# EAGLE design opt_isp6_prg_header (EAGLE 9.6.2)
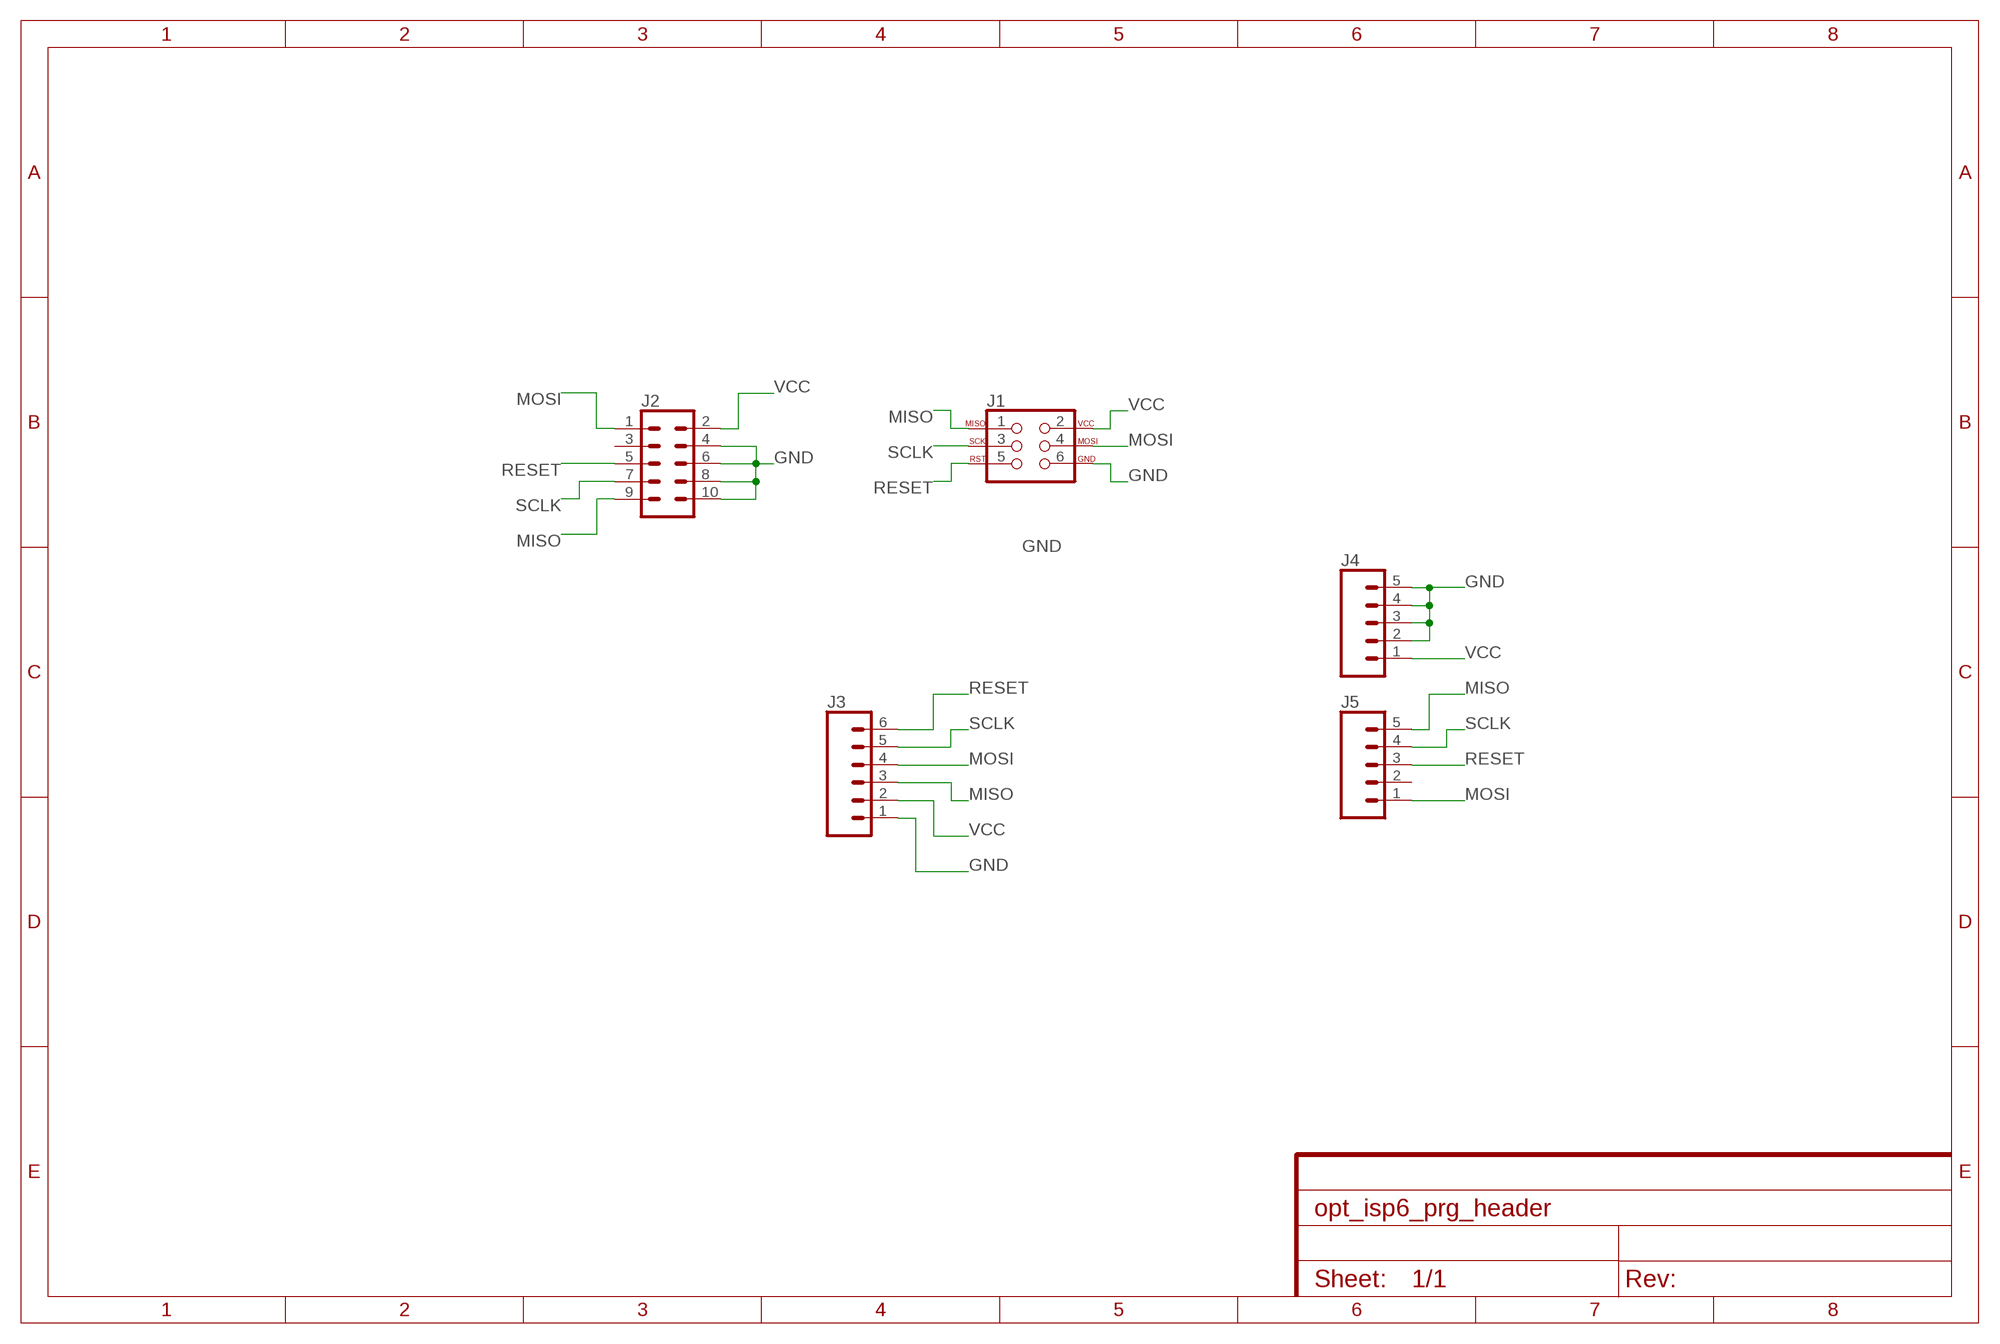
[diagram p0: schematic, sheet 1]

## Parts
J1  AVR_SPI_PROG_3X2NS  [2X3-NS]
J2  CONN_05X2SHD  [2X5-SHROUDED]
J3  CONN_06NO_SILK_NO_POP  [1X06_NO_SILK]
J4  CONN_05VERT_FEMALE_HEADER  [1X05_SMD_VERTICAL_COMBO]
J5  CONN_05VERT_FEMALE_HEADER  [1X05_SMD_VERTICAL_COMBO]

## Nets
GND: J1.6 J2.4 J2.6 J2.8 J2.10 J3.1 J4.2 J4.3 J4.4 J4.5
MISO: J1.1 J2.9 J3.3 J5.5
MOSI: J1.4 J2.1 J3.4 J5.1
RESET: J1.5 J2.5 J3.6 J5.3
SCLK: J1.3 J2.7 J3.5 J5.4
VCC: J1.2 J2.2 J3.2 J4.1
Unconnected: J2.3 J5.2

## Library data of the parts
J1 = SparkFun-Connectors:AVR_SPI_PROG_3X2: AVR ISP 6 Pin This is the reduced ISP connector for AVR programming. Common on Arduino. This footprint will take up less PCB space and can be used with a 10-pin to 6-pin adapter such as SKU: BOB-08508 **Special note about "TEST_POINT" package. The stop mask is on the top side, so if you want your programming test points to be on the bottom of your board, make sure to place this package on the bottom side of the board. This also ensure that the orientation to program from the bottom side will be correct. SparkFun Products: SparkFun ISP Pogo Adapter <https://www.sparkfun.com/products/11591> - NS Tiny AVR Programmer <https://www.sparkfun.com/products/11801> -PTH
J2 = SparkFun-Connectors:CONN_05X2: Multi connection point. Often used as Generic Header-pin footprint for 0.1 inch spaced/style header connections For AVR SPI programming port, see special device with nice symbol: "AVR_SPI_PROG_5x2.dev" You can populate with any combo of single row headers, but if you'd like an exact match, check these: 2x5 AVR ICSP Male Header <https://www.sparkfun.com/products/778> (PRT-00778) 2x5 Pin Shrouded Header <https://www.sparkfun.com/products/8506> (PRT-08506) On any of the 0.1 inch spaced packages, you can populate with these: Break Away Headers - Straight <https://www.sparkfun.com/products/116> (PRT-00116) Break Away Male Headers - Right Angle <https://www.sparkfun.com/products/553> (PRT-00553) Female Headers <https://www.sparkfun.com/products/115> (PRT-00115) Break Away Headers - Machine Pin <https://www.sparkfun.com/products/117> (PRT-00117) Break Away Female Headers - Swiss Machine Pin <https://www.sparkfun.com/products/743> (PRT-00743) Special note: the shrouded connector mates well with our 5x2 ribbon cables: 2x5 Pin IDC Ribbon Cable <https://www.sparkfun.com/products/8535> (PRT-08535); PROD_ID: CONN-08671; SF_ID: PRT-08506
J3 = SparkFun-Connectors:CONN_06: Multi connection point. Often used as Generic Header-pin footprint for 0.1 inch spaced/style header connections On any of the 0.1 inch spaced packages, you can populate with these: Break Away Headers - Straight <https://www.sparkfun.com/products/116> (PRT-00116) Break Away Male Headers - Right Angle <https://www.sparkfun.com/products/553> (PRT-00553) Female Headers <https://www.sparkfun.com/products/115> (PRT-00115) Break Away Headers - Machine Pin <https://www.sparkfun.com/products/117> (PRT-00117) Break Away Female Headers - Swiss Machine Pin <https://www.sparkfun.com/products/743> (PRT-00743) Arduino Stackable Header - 6 Pin <https://www.sparkfun.com/products/9280> (PRT-09280) For SCREWTERMINALS and SPRING TERMINALS visit here: Screw Terimnals on SparkFun.com <https://www.sparkfun.com/search/results?term=Screw+Terminals> (5mm/3.5mm/2.54mm spacing) This device is also useful as a general connection point to wire up your design to another part of your project. Our various solder wires solder well into these plated through hole pads. Hook-Up Wire - Assortment (Stranded, 22 AWG) <https://www.sparkfun.com/products/11375> (PRT-11375) Hook-Up Wire - Assortment (Solid Core, 22 AWG) <https://www.sparkfun.com/products/11367> (PRT-11367) View the entire wire category on our website here <https://www.sparkfun.com/categories/141>
J4 J5 = SparkFun-Connectors:CONN_05: Multi connection point. Often used as Generic Header-pin footprint for 0.1 inch spaced/style header connections On any of the 0.1 inch spaced packages, you can populate with these: Break Away Headers - Straight <https://www.sparkfun.com/products/116> (PRT-00116) Break Away Male Headers - Right Angle <https://www.sparkfun.com/products/553> (PRT-00553) Female Headers <https://www.sparkfun.com/products/115> (PRT-00115) Break Away Headers - Machine Pin <https://www.sparkfun.com/products/117> (PRT-00117) Break Away Female Headers - Swiss Machine Pin <https://www.sparkfun.com/products/743> (PRT-00743) For SCREWTERMINALS and SPRING TERMINALS visit here: Screw Terimnals on SparkFun.com <https://www.sparkfun.com/search/results?term=Screw+Terminals> (5mm/3.5mm/2.54mm spacing) This device is also useful as a general connection point to wire up your design to another part of your project. Our various solder wires solder well into these plated through hole pads. Hook-Up Wire - Assortment (Stranded, 22 AWG) <https://www.sparkfun.com/products/11375> (PRT-11375) Hook-Up Wire - Assortment (Solid Core, 22 AWG) <https://www.sparkfun.com/products/11367> (PRT-11367) View the entire wire category on our website here <https://www.sparkfun.com/categories/141> Special notes: Molex polarized connector foot print use with SKU : PRT-08231 with associated crimp pins and housings. 1MM SMD Version SKU: PRT-10208; PROD_ID: CONN-15262

## Board
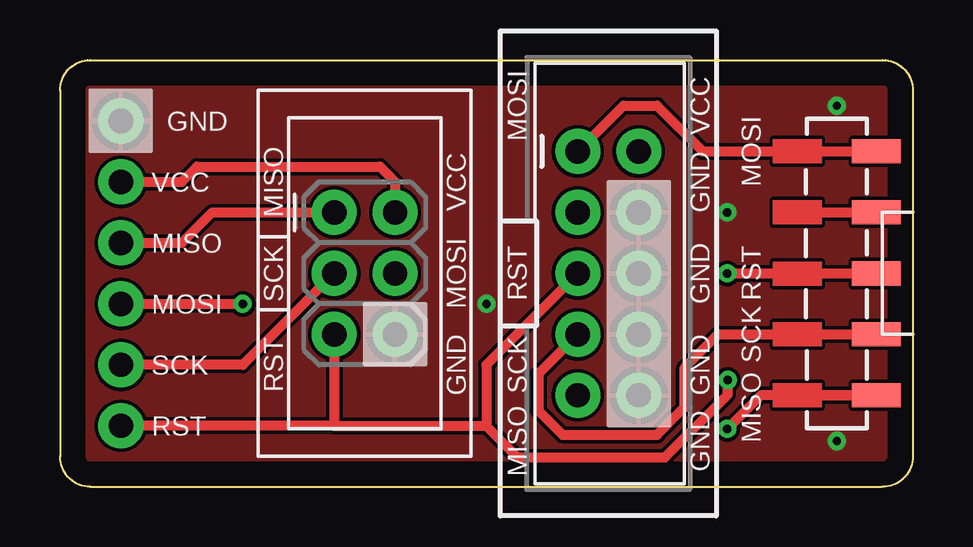
[diagram p1: board, top side]
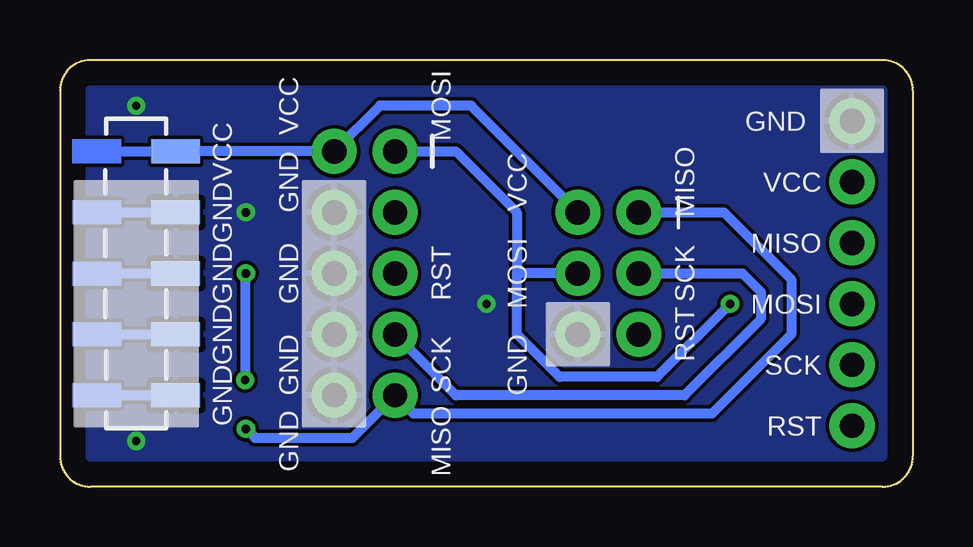
[diagram p2: board, bottom side, seen from below]

Size 35.56 x 17.78 mm. Coordinates in mm from the lower left corner, seen from the top.
Outline: 1.27,0 34.29,0 arc90 35.56,1.27 35.56,16.51 arc90 34.29,17.78 1.27,17.78 arc90 0,16.51 0,1.27 arc90 1.27,0
Copper layers (1*16): Top 0.035mm / dielectric 1.5mm / Bottom 0.035mm
Design rules "default": minimum track width 6mil, minimum drill 0.35mm, track to track 6mil, track to pad 6mil, pad to pad 6mil, via to via 6mil, smd to smd 6mil, copper to edge 40mil, drill to drill 6mil, minimum pad ring 10mil, minimum via ring 8mil, stop-mask expansion 4mil, vias tented up to drill 0mil, thermal gap 10mil

### Footprints (pad centres in the part's own frame; a part is rotated, then mirrored left to right if it is on the bottom)
2X3-NS = drill 1.016 pad 1.88: 1 -2.54,-1.27; 2 -2.54,1.27; 3 0,-1.27; 4 0,1.27; 5 2.54,-1.27; 6 2.54,1.27
2X5-SHROUDED = drill 1.016 pad 1.88: 1 -1.27,5.08; 2 1.27,5.08; 3 -1.27,2.54; 4 1.27,2.54; 5 -1.27,0; 6 1.27,0; 7 -1.27,-2.54; 8 1.27,-2.54; 9 -1.27,-5.08; 10 1.27,-5.08
1X06_NO_SILK = drill 1.016 pad 1.88: 1 0,0; 2 2.54,0; 3 5.08,0; 4 7.62,0; 5 10.16,0; 6 12.7,0
1X05_SMD_VERTICAL_COMBO = smd 1 x 2: 1 0,1.65; 2 2.54,1.65; 3 5.08,1.65; 4 7.62,1.652; 5 10.16,1.65

### Placement (x,y rotation side)
J1  12.7,8.89 270 top
J2  22.86,8.89 0 top
J3  2.54,15.24 270 top
J4  32.38,13.97 270 bottom
J5  32.38,13.97 270 top

### Tracks (layer width: path | path; a pad name or v marks a point on that pad's centre or on a via)
GND  (via drill 0.35)
  other vias: 17.78,7.62 27.81,11.43 32.38,15.88 32.38,1.91
  pour Bottom: 0,17.78 0,0 35.56,0 35.56,17.78
  pour Top: 0,17.78 0,0 35.56,0 35.56,17.78
MISO  (via drill 0.35)
  Top 0.406: J3.3 5.08,10.16 6.35,11.43 J1.1 | J5.5 29.21,3.81 v27.81,2.41
  Bottom 0.406: J1.1 7.87,11.43 5.08,8.64 5.08,6.35 8.38,3.05 20.83,3.05 J2.9 23.37,2.03 27.43,2.03 v27.81,2.41
MOSI  (via drill 0.35)
  Top 0.406: J3.4 v7.62,7.62 | J2.1 23.5,15.88 24.89,15.88 26.8,13.97 J5.1
  Bottom 0.406: v7.62,7.62 10.67,4.57 14.73,4.57 16.51,6.35 16.51,8.89 | J2.1 19.05,13.97 16.51,11.43 16.51,8.89 | J1.4 16.51,8.89
RESET  (via drill 0.35)
  Top 0.406: 11.43,2.54 J3.6 | J1.5 11.43,2.54 | v27.81,8.89 J5.3 | 11.43,2.54 17.75,2.54 19.07,1.22 25.22,1.22 27.84,3.84 v27.84,4.45 | J2.5 17.78,5.08 17.78,2.54
  Bottom 0.406: v27.81,8.89 27.84,8.86 v27.84,4.45
SCLK
  Top 0.406: J1.3 7.62,5.08 J3.5 | J2.7 19.94,4.7 19.94,3.17 20.95,2.16 24.89,2.16 26.04,3.3 26.04,4.95 27.43,6.35 J5.4
  Bottom 0.406: J1.3 7.11,8.89 6.35,8.13 6.35,6.99 9.53,3.81 19.05,3.81 J2.7
VCC
  Top 0.406: J3.2 5.08,12.7 5.71,13.34 13.34,13.34 13.97,12.7 J1.2
  Bottom 0.406: J1.2 18.41,15.88 22.23,15.88 J2.2 J4.1

### Text on the board
tNames: MOSI | VCC | GND | MOSI | VCC | MISO | VCC | GND | MISO | SCK | MOSI | RST | GND | RST | MOSI | SCK | SCK | RST | GND | SCK | GND | RST | MISO | MISO | GND
bNames: MOSI | VCC | GND | VCC | VCC | MISO | VCC | GND | GND | MISO | SCK | MOSI | RST | GND | GND | MOSI | RST | GND | SCK | GND | SCK | GND | GND | RST | MISO | GND